# EAGLE schematic bqcreative_v2 (EAGLE 7.2.0)

## Sheet 1 of 3
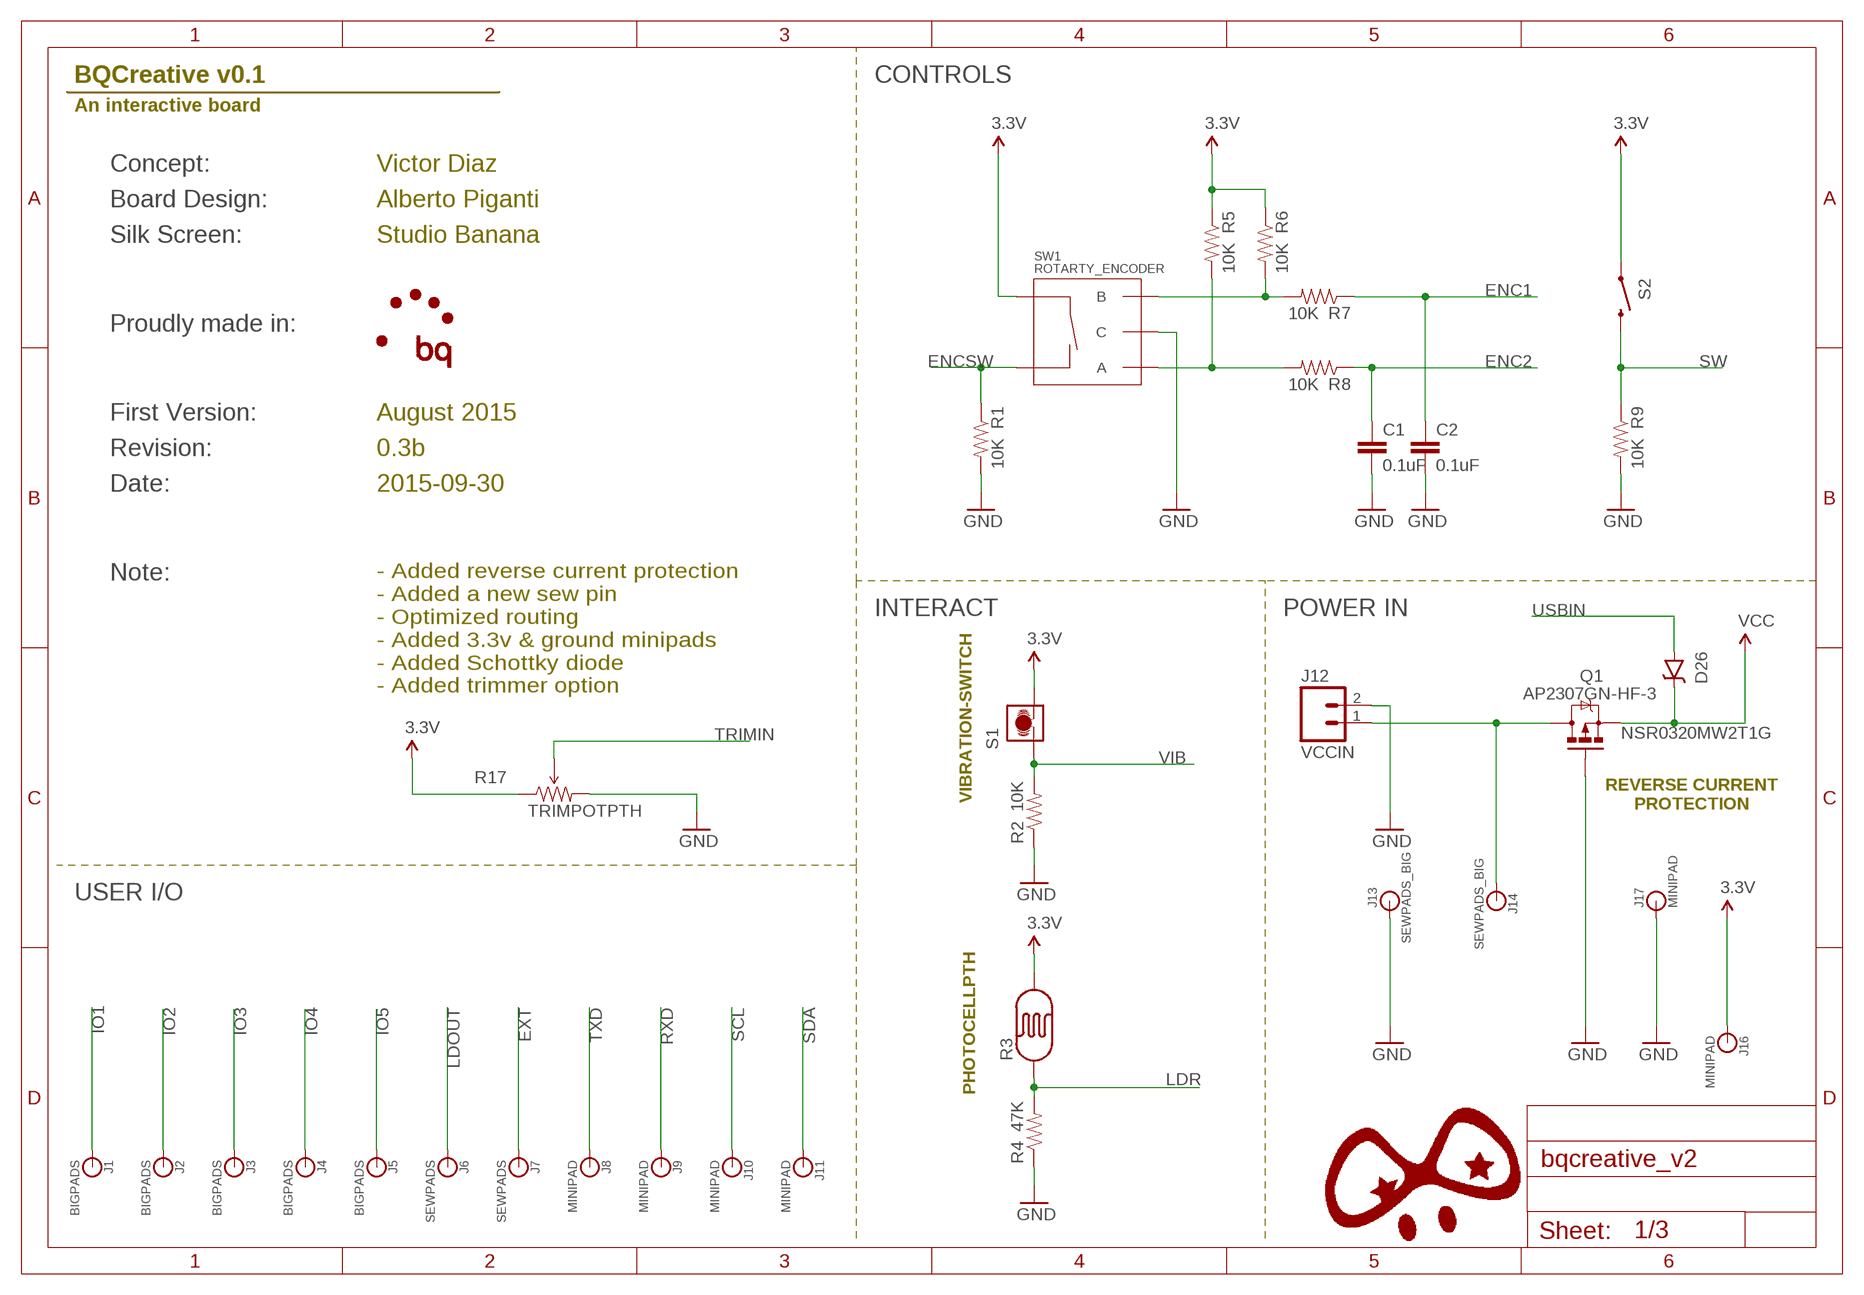
[diagram p0: schematic, sheet 1]

### Parts
C1  0.1uF  CAP0603-CAP  [0603-CAP]
C2  0.1uF  CAP0603-CAP  [0603-CAP]
D26  NSR0320MW2T1G  DIODE-SCHOTTKY-PMEG4005EJ  [SOD-323]
J1  BIGPADS  [BIGPAD]
J2  BIGPADS  [BIGPAD]
J3  BIGPADS  [BIGPAD]
J4  BIGPADS  [BIGPAD]
J5  BIGPADS  [BIGPAD]
J6  SEWPADS  [SEWPAD]
J7  SEWPADS  [SEWPAD]
J8  MINIPAD  [MINIPAD]
J9  MINIPAD  [MINIPAD]
J10  MINIPAD  [MINIPAD]
J11  MINIPAD  [MINIPAD]
J12  VCCIN  M02POLAR  [MOLEX-1X2]
J13  SEWPADS_BIG  [SEWPAD_BIG]
J14  SEWPADS_BIG  [SEWPAD_BIG]
J16  MINIPAD  [MINIPAD]
J17  MINIPAD  [MINIPAD]
Q1  AP2307GN-HF-3  MOSFET-PCHANNEL  [SOT23-3]
R1  10K  RESISTOR0402-RES  [0402-RES]
R2  10K  RESISTOR0402-RES  [0402-RES]
R3  PHOTOCELLPTH  [PHOTOCELL]
R4  47K  RESISTOR0402-RES  [0402-RES]
R5  10K  RESISTOR0402-RES  [0402-RES]
R6  10K  RESISTOR0402-RES  [0402-RES]
R7  10K  RESISTOR0402-RES  [0402-RES]
R8  10K  RESISTOR0402-RES  [0402-RES]
R9  10K  RESISTOR0402-RES  [0402-RES]
R17  TRIMPOTPTH  [TRIM_POT_PTH]
S1  VIBRATION-SWITCH  [VIBRATION-SWITCH]
S2  SWITCH-MOMENTARY-2SMD  [TACTILE-SWITCH-SMD]
SW1  ROTARTY_ENCODER  [ROTARY_ENC_PLAIN]

### Nets
3.3V: J16.P$1 J16.P$2 R3.2 R5.1 R6.1 R17.1(CCW) S1.2 S2.1 SW1.SW+ ; also sheet 2
ENC1: C2.1 R7.1 ; also sheet 2
ENC2: C1.1 R8.1 ; also sheet 2
ENCSW: R1.1 SW1.SW- ; also sheet 2
EXT: J7.P$1 ; also sheet 2
GND: C1.2 C2.2 J12.2 J13.P$1 J17.P$1 J17.P$2 Q1.1(G) R1.2 R2.1 R4.1 R9.2 R17.3(CW) SW1.C ; also sheet 2,3
IO1: J1.P$1 ; also sheet 2
IO2: J2.P$1 ; also sheet 2
IO3: J3.P$1 ; also sheet 2
IO4: J4.P$1 ; also sheet 2
IO5: J5.P$1 ; also sheet 2
LDOUT: J6.P$1 ; also sheet 3
LDR: R3.1 R4.2 ; also sheet 2
N$15: J12.1 J14.P$1 Q1.3(D)
N$18: R6.2 R7.2 SW1.B
N$19: R5.2 R8.2 SW1.A
RXD: J9.P$1 J9.P$2 ; also sheet 2
SCL: J10.P$1 J10.P$2 ; also sheet 2
SDA: J11.P$1 J11.P$2 ; also sheet 2
SW: R9.1 S2.3 ; also sheet 2
TRIMIN: R17.2(WIPER) ; also sheet 2
TXD: J8.P$1 J8.P$2 ; also sheet 2
USBIN: D26.A ; also sheet 2
VCC: D26.C Q1.2(S) ; also sheet 2,3
VIB: R2.2 S1.1 ; also sheet 2

### Notes on the sheet
- BQCreative v0.1 | CONTROLS
- An interactive board
- Concept: | Victor Diaz
- Board Design: | Alberto Piganti
- Silk Screen: | Studio Banana
- Proudly made in:
- First Version: | August 2015
- Revision: | 0.3b
- Date: | 2015-09-30
- Note:
- - Added reverse current protection
  - Added a new sew pin
  - Optimized routing
  - Added 3.3v & ground minipads
  - Added Schottky diode
  - Added trimmer option
- INTERACT | POWER IN
- REVERSE CURRENT
  PROTECTION
- USER I/O

## Sheet 2 of 3
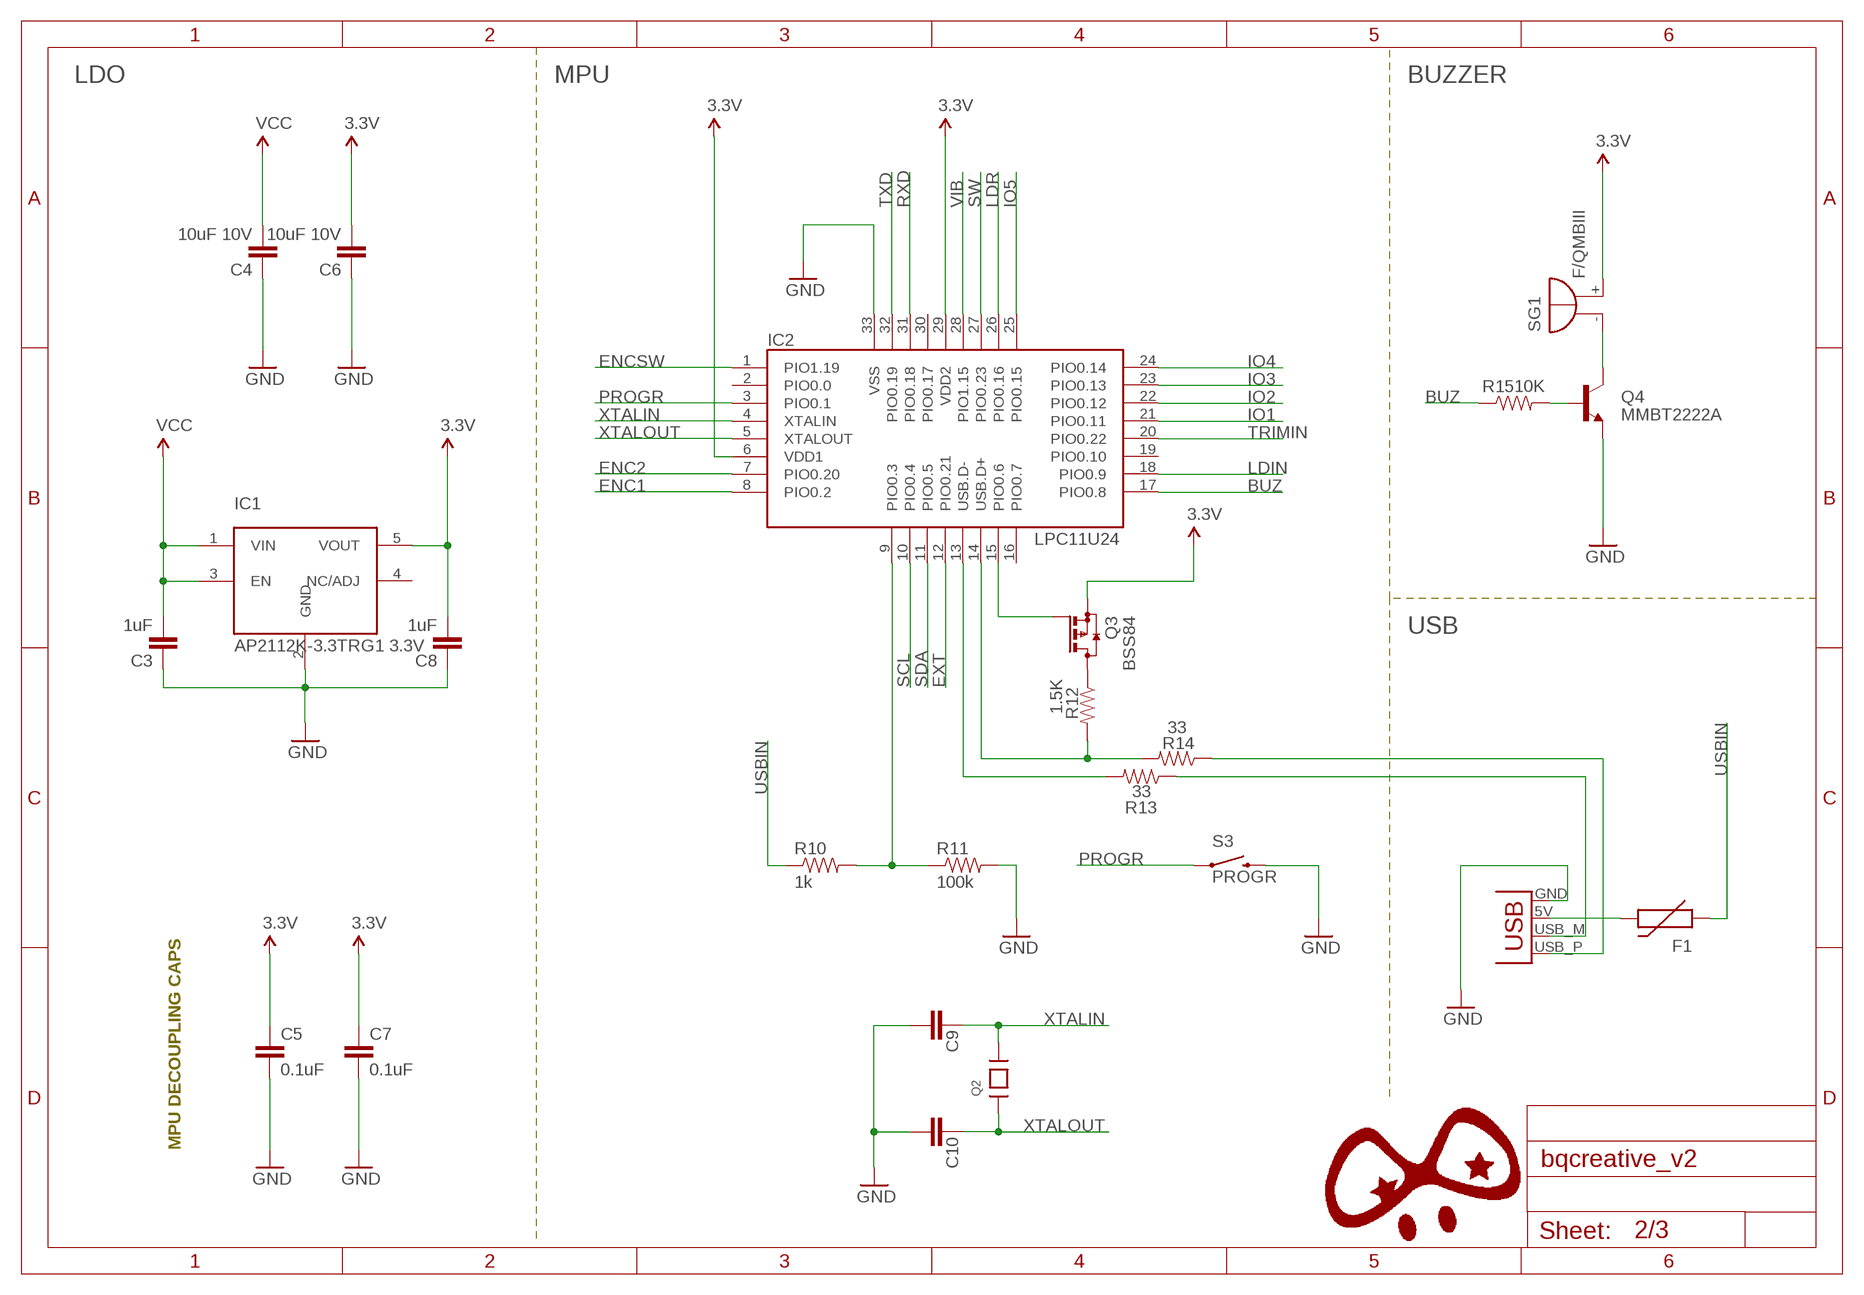
[diagram p1: schematic, sheet 2]

### Parts
C3  1uF  CAP0402-CAP  [0402-CAP]
C4  10uF 10V  CAP0402-CAP  [0402-CAP]
C5  0.1uF  CAP0402-CAP  [0402-CAP]
C6  10uF 10V  CAP0402-CAP  [0402-CAP]
C7  0.1uF  CAP0402-CAP  [0402-CAP]
C8  1uF  CAP0402-CAP  [0402-CAP]
C9  27pF  CAP0402-CAP  [0402-CAP]
C10  27pF  CAP0402-CAP  [0402-CAP]
F1  PTC0603  [0603]
IC1  AP2112K-3.3TRG1 3.3V  5PIN_REG  [SOT23-5]
IC2  LPC11U24  LPC11U2X_HVQFN33(5X5)  [HVQFN33_5X5MM]
J15  USBPCB  [USB-A-PCB]
Q2  12MHz 4 pad crystal 3.2x2.5  CRYSTAL3.2X2.5  [CRYSTAL_3.2X2.5]
Q3  BSS84  [SOT23]
Q4  MMBT2222A  TRANSISTOR_NPNMMBT2222A  [SOT23-3]
R10  1k  RESISTOR0402-RES  [0402-RES]
R11  100k  RESISTOR0402-RES  [0402-RES]
R12  1.5K  RESISTOR0402-RES  [0402-RES]
R13  33  RESISTOR0402-RES  [0402-RES]
R14  33  RESISTOR0402-RES  [0402-RES]
R15  10K  RESISTOR0402-RES  [0402-RES]
S3  PROGR  SWITCH-MOMENTARY-2SMD-1101NE  [TACTILE-SWITCH-1101NE]
SG1  F/QMBIII  [F/QMBIII]

### Nets
3.3V: C5.1 C6.2 C7.1 C8.2 IC1.5(VOUT) IC2.6(VDD1) IC2.29(VDD2) Q3.2(S) SG1.+(-) ; also sheet 1
BUZ: IC2.17(PIO0.8) R15.1
ENC1: IC2.8(PIO0.2) ; also sheet 1
ENC2: IC2.7(PIO0.20) ; also sheet 1
ENCSW: IC2.1(PIO1.19) ; also sheet 1
EXT: IC2.12(PIO0.21) ; also sheet 1
GND: C3.1 C4.1 C5.2 C6.1 C7.2 C8.1 C9.2 C10.2 IC1.2(GND) IC2.33(VSS) J15.GND Q4.2(E) R11.2 S3.2 ; also sheet 1,3
IO1: IC2.21(PIO0.11) ; also sheet 1
IO2: IC2.22(PIO0.12) ; also sheet 1
IO3: IC2.23(PIO0.13) ; also sheet 1
IO4: IC2.24(PIO0.14) ; also sheet 1
IO5: IC2.25(PIO0.15) ; also sheet 1
LDIN: IC2.18(PIO0.9) ; also sheet 3
LDR: IC2.26(PIO0.16) ; also sheet 1
N$7: Q4.3(C) SG1.-(+)
N$8: Q4.1(B) R15.2
N$9: J15.USB_P(D+) R14.1
N$10: F1.2 J15.5V(VBUS)
N$11: J15.USB_M(D-) R13.1
N$33: IC2.14(USB.D+) R12.2 R14.2
N$34: IC2.13(USB.D-) R13.2
N$35: Q3.3(D) R12.1
N$36: IC2.15(PIO0.6) Q3.1(G)
P0.3/ISP_COMMAND_USB_HIGH: IC2.9(PIO0.3) R10.2 R11.1
PROGR: IC2.3(PIO0.1) S3.1
RXD: IC2.31(PIO0.18) ; also sheet 1
SCL: IC2.10(PIO0.4) ; also sheet 1
SDA: IC2.11(PIO0.5) ; also sheet 1
SW: IC2.27(PIO0.23) ; also sheet 1
TRIMIN: IC2.20(PIO0.22) ; also sheet 1
TXD: IC2.32(PIO0.19) ; also sheet 1
USBIN: F1.1 R10.1 ; also sheet 1
VCC: C3.2 C4.2 IC1.1(VIN) IC1.3(EN) ; also sheet 1,3
VIB: IC2.28(PIO1.15) ; also sheet 1
XTALIN: C9.1 IC2.4(XTALIN) Q2.3
XTALOUT: C10.1 IC2.5(XTALOUT) Q2.1
Unconnected: IC1.4(NC/ADJ) IC2.2(PIO0.0) IC2.16(PIO0.7) IC2.19(PIO0.10) IC2.30(PIO0.17)

### Notes on the sheet
- LDO | MPU | BUZZER
- USB
- MPU DECOUPLING CAPS

## Sheet 3 of 3
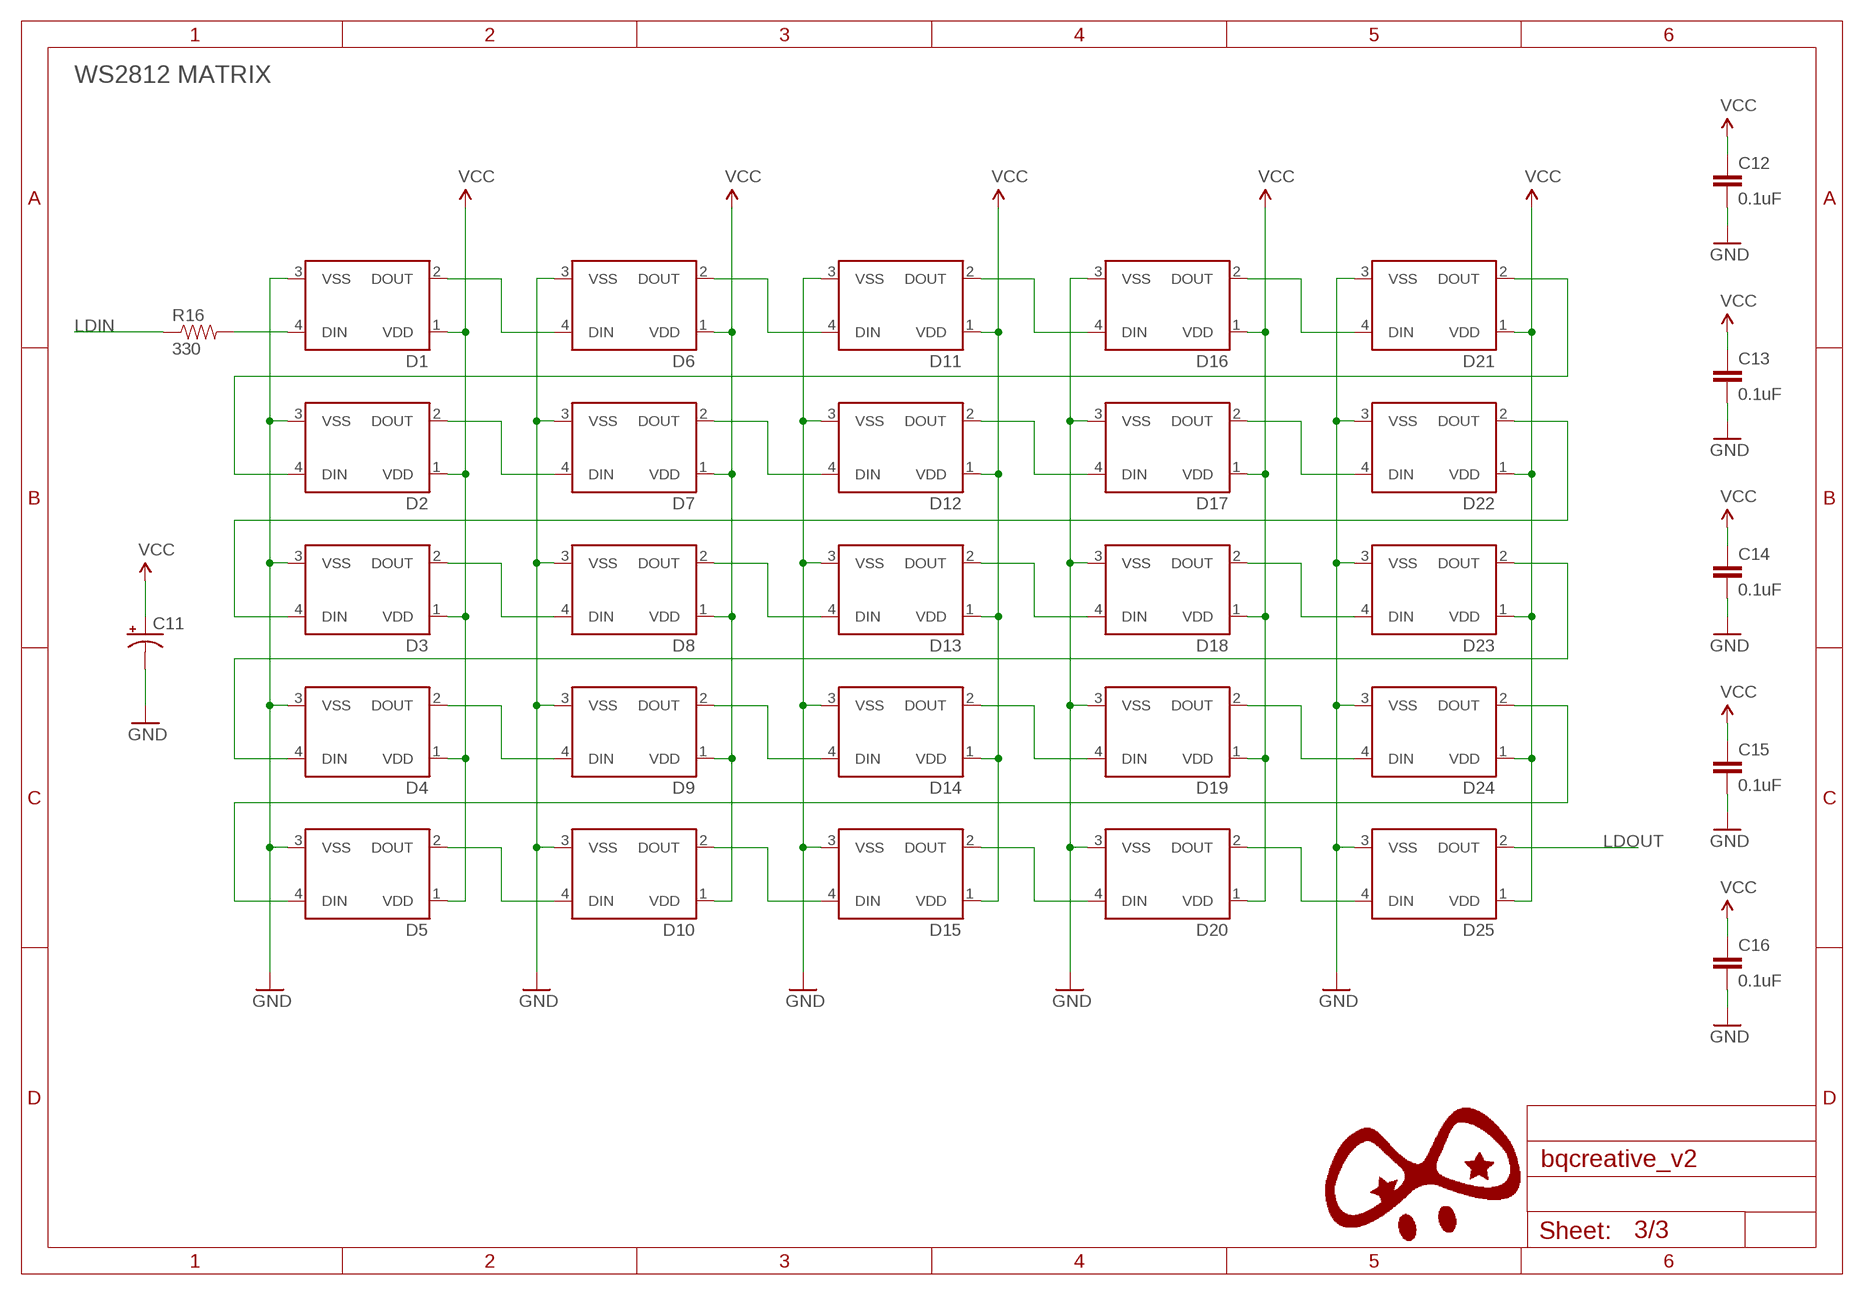
[diagram p2: schematic, sheet 3]

### Parts
C11  CAP_POL1206  [EIA3216]
C12  0.1uF  CAP0402-CAP  [0402-CAP]
C13  0.1uF  CAP0402-CAP  [0402-CAP]
C14  0.1uF  CAP0402-CAP  [0402-CAP]
C15  0.1uF  CAP0402-CAP  [0402-CAP]
C16  0.1uF  CAP0402-CAP  [0402-CAP]
D1  WS2812B  [WS2812B]
D2  WS2812B  [WS2812B]
D3  WS2812B  [WS2812B]
D4  WS2812B  [WS2812B]
D5  WS2812B  [WS2812B]
D6  WS2812B  [WS2812B]
D7  WS2812B  [WS2812B]
D8  WS2812B  [WS2812B]
D9  WS2812B  [WS2812B]
D10  WS2812B  [WS2812B]
D11  WS2812B  [WS2812B]
D12  WS2812B  [WS2812B]
D13  WS2812B  [WS2812B]
D14  WS2812B  [WS2812B]
D15  WS2812B  [WS2812B]
D16  WS2812B  [WS2812B]
D17  WS2812B  [WS2812B]
D18  WS2812B  [WS2812B]
D19  WS2812B  [WS2812B]
D20  WS2812B  [WS2812B]
D21  WS2812B  [WS2812B]
D22  WS2812B  [WS2812B]
D23  WS2812B  [WS2812B]
D24  WS2812B  [WS2812B]
D25  WS2812B  [WS2812B]
R16  330  RESISTOR0402-RES  [0402-RES]

### Nets
GND: C11.C(-) C12.2 C13.2 C14.2 C15.2 C16.2 D1.3(VSS) D2.3(VSS) D3.3(VSS) D4.3(VSS) D5.3(VSS) D6.3(VSS) D7.3(VSS) D8.3(VSS) D9.3(VSS) D10.3(VSS) D11.3(VSS) D12.3(VSS) D13.3(VSS) D14.3(VSS) D15.3(VSS) D16.3(VSS) D17.3(VSS) D18.3(VSS) D19.3(VSS) D20.3(VSS) D21.3(VSS) D22.3(VSS) D23.3(VSS) D24.3(VSS) D25.3(VSS) ; also sheet 1,2
LDIN: R16.1 ; also sheet 2
LDOUT: D25.2(DOUT) ; also sheet 1
N$13: D1.4(DIN) R16.2
N$22: D1.2(DOUT) D6.4(DIN)
N$27: D6.2(DOUT) D11.4(DIN)
N$32: D11.2(DOUT) D16.4(DIN)
N$40: D16.2(DOUT) D21.4(DIN)
N$41: D2.2(DOUT) D7.4(DIN)
N$46: D7.2(DOUT) D12.4(DIN)
N$49: D12.2(DOUT) D17.4(DIN)
N$52: D17.2(DOUT) D22.4(DIN)
N$53: D3.2(DOUT) D8.4(DIN)
N$58: D8.2(DOUT) D13.4(DIN)
N$61: D13.2(DOUT) D18.4(DIN)
N$64: D18.2(DOUT) D23.4(DIN)
N$65: D4.2(DOUT) D9.4(DIN)
N$70: D9.2(DOUT) D14.4(DIN)
N$73: D14.2(DOUT) D19.4(DIN)
N$76: D19.2(DOUT) D24.4(DIN)
N$77: D5.2(DOUT) D10.4(DIN)
N$82: D10.2(DOUT) D15.4(DIN)
N$85: D15.2(DOUT) D20.4(DIN)
N$88: D20.2(DOUT) D25.4(DIN)
N$91: D2.4(DIN) D21.2(DOUT)
N$92: D3.4(DIN) D22.2(DOUT)
N$93: D4.4(DIN) D23.2(DOUT)
N$94: D5.4(DIN) D24.2(DOUT)
VCC: C11.A(+) C12.1 C13.1 C14.1 C15.1 C16.1 D1.1(VDD) D2.1(VDD) D3.1(VDD) D4.1(VDD) D5.1(VDD) D6.1(VDD) D7.1(VDD) D8.1(VDD) D9.1(VDD) D10.1(VDD) D11.1(VDD) D12.1(VDD) D13.1(VDD) D14.1(VDD) D15.1(VDD) D16.1(VDD) D17.1(VDD) D18.1(VDD) D19.1(VDD) D20.1(VDD) D21.1(VDD) D22.1(VDD) D23.1(VDD) D24.1(VDD) D25.1(VDD) ; also sheet 1,2

### Notes on the sheet
- WS2812 MATRIX

## Library data of the parts
C1 C2 = SparkFun-Capacitors:CAP: Capacitor Standard 0603 ceramic capacitor, and 0.1" leaded capacitor.
C3-C10 C12-C16 = SparkFun-Passives:CAP: Capacitor Standard 0603 ceramic capacitor, and 0.1" leaded capacitor.
C11 = SparkFun-Capacitors:CAP_POL: Capacitor Polarized These are standard SMD and PTH capacitors. Normally 10uF, 47uF, and 100uF in electrolytic and tantalum varieties. Always verify the external diameter of the through hole cap, it varies with capacity, voltage, and manufacturer. The EIA devices should be standard.
D1-D25 = SparkFun-LED:WS2812B: WS2812B - Intelligent control LED integrated light source Technical Specifications: Power Supply Voltage (VDD): 3.5 to 5.3 V Input Voltage (VI): -0.5 to VDD+0.5 V Operating Junction Temperature (Topt): -25°C to +80°C Storage Temperature Range (Tstg): -55°C to +150°C
D26 = SparkFun-DiscreteSemi:DIODE-SCHOTTKY: Schottky diodes in SFE's production catalog BAT20J 1A 23V 0.62Vf RB751 120mA 40V 0.37Vf PMEG4005EJ 0.5A 40V 0.42Vf MBRA140 1A 40V 0.5Vf B340A 3A 40V SMA; PROD_ID: DIO-10955; VALUE: PMEG4005EJ
F1 = SparkFun-PowerIC:PTC: Resettable Fuse PTC Resettable Fuse. Spark Fun Electronics SKU : COM-08357
IC1 = GHI:5PIN_REG
IC2 = GHI-SoMs-Processors:LPC11U2X_HVQFN33(5X5)
J1-J5 = bqCreative:BIGPADS: BQCreative Pads
J6 J7 = bqCreative:SEWPADS
J8-J11 J16 J17 = bqCreative:MINIPAD: BQCreative mini pads for signals
J12 = SparkFun-Connectors:M02: Standard 2-pin 0.1" header. Use with - straight break away headers ( PRT-00116) - right angle break away headers (PRT-00553) - swiss pins (PRT-00743) - machine pins (PRT-00117) - female headers (PRT-00115) Molex polarized connector foot print use with: PRT-08233 with associated crimp pins and housings. 2.54_SCREWTERM for use with PRT-10571. 3.5mm Screw Terminal footprints for PRT-08084 5mm Screw Terminal footprints for use with PRT-08432
J13 J14 = bqCreative:SEWPADS_BIG: BQCreative Sew pads (bottom)
J15 = SparkFun-Connectors:USB: USB Connectors USB-B-PTH is fully proven SKU : PRT-00139/CONN-08278 USB-miniB is fully proven SKU : PRT-00587 USB-A-PCB is untested. USB-A-H is throughly reviewed, but untested. Spark Fun Electronics SKU : PRT-00437 USB-B-SMT is throughly reviewed, but untested. Needs silkscreen touching up. USB-A-S has not been used/tested USB-MB-H has not been used/tested USB-MICROB has been used. CONN-09505
Q1 = SparkFun-DiscreteSemi:MOSFET-PCHANNEL: Generic PMOSFET IRLML2244 - TRANS-11153 (SOT-23 -20V -4.3A) (1.Gate 2.Source 3.Drain) FQP27P06 - COM-10349 <http://www.sparkfun.com/products/10349> (TO-220 -60V -27A) (1.Gate 2.Source 3.Drain); PROD_ID: TRANS-08285
Q2 = GHI:CRYSTAL3.2X2.5
Q3 = transistor-small-signal:BSS84: P-CHANNEL MOS FET
Q4 = SparkFun-DiscreteSemi:TRANSISTOR_NPN: Generic NPN BJT MMBT2222A - TRANS-08049 (SOT-23, 1A 40V) MPSA42 - TRANS-09116 (SOT-23, 500mA 300V) MMBT5088LT1G - TRANS-11160 (SOT-23, 50 mA 30V) BC547 - COM-08928 <http://www.sparkfun.com/products/8928> (TO-92 45V 100mA) (1.Collector 2.Base 3.Emitter) 2N3904 - COM-00521 <http://www.sparkfun.com/products/521> (TO-92 40V 200mA) (1.Emitter 2.Base 3.Collector) P2N2222A - COM-12852 <http://www.sparkfun.com/products/12852> (TO-92 40V 600mA) (1.Collector 2.Base 3.Emitter); PROD_ID: TRANS-08049
R1 R2 R4-R9 R15 = SparkFun:RESISTOR: Resistor Basic schematic elements and footprints for 0603, 1206, and PTH resistors.
R3 = SparkFun-Sensors:PHOTOCELL: CdS photoresistor. This is a low cost way to detect light levels. Resistance decreases with more incoming light. SparkFun SKU: SEN-09088
R10-R14 R16 = SparkFun-Passives:RESISTOR: Resistor Basic schematic elements and footprints for 0603, 1206, and PTH resistors.
R17 = SparkFun-Electromechanical:TRIMPOT: Various small potentiometers for "set-and-forget" applications
S1 = mic2026:VIBRATION-SWITCH
S2 = SparkFun-Electromechanical:SWITCH-MOMENTARY-2: Various NO switches- pushbuttons, reed, etc; PROD_ID: SWCH-08247
S3 = SparkFun-Electromechanical:SWITCH-MOMENTARY-2: Various NO switches- pushbuttons, reed, etc; PROD_ID: SWCH-00815
SG1 = buzzer:F/QMBIII: BUZZER Source: Buerklin; OC_FARNELL: unknown; OC_NEWARK: unknown
SW1 = SparkFun-Electromechanical:ROTARTY_ENCODER: Simple no LED rotary encoder Example: COM-09117

## Net classes
0 default: width 0.254 mm, drill 0.254 mm, clearance 0.203 mm
1 power: width 0.61 mm, drill 0.61 mm, clearance 0.254 mm